# EasyEDA schematic CLIPPER SCHEMATIC.json
TITLE: Sheet_1; REV: 1.0; Date: 2023-09-24; Sheet: 1/1; Drawn By: pv8821; Company: Your Company
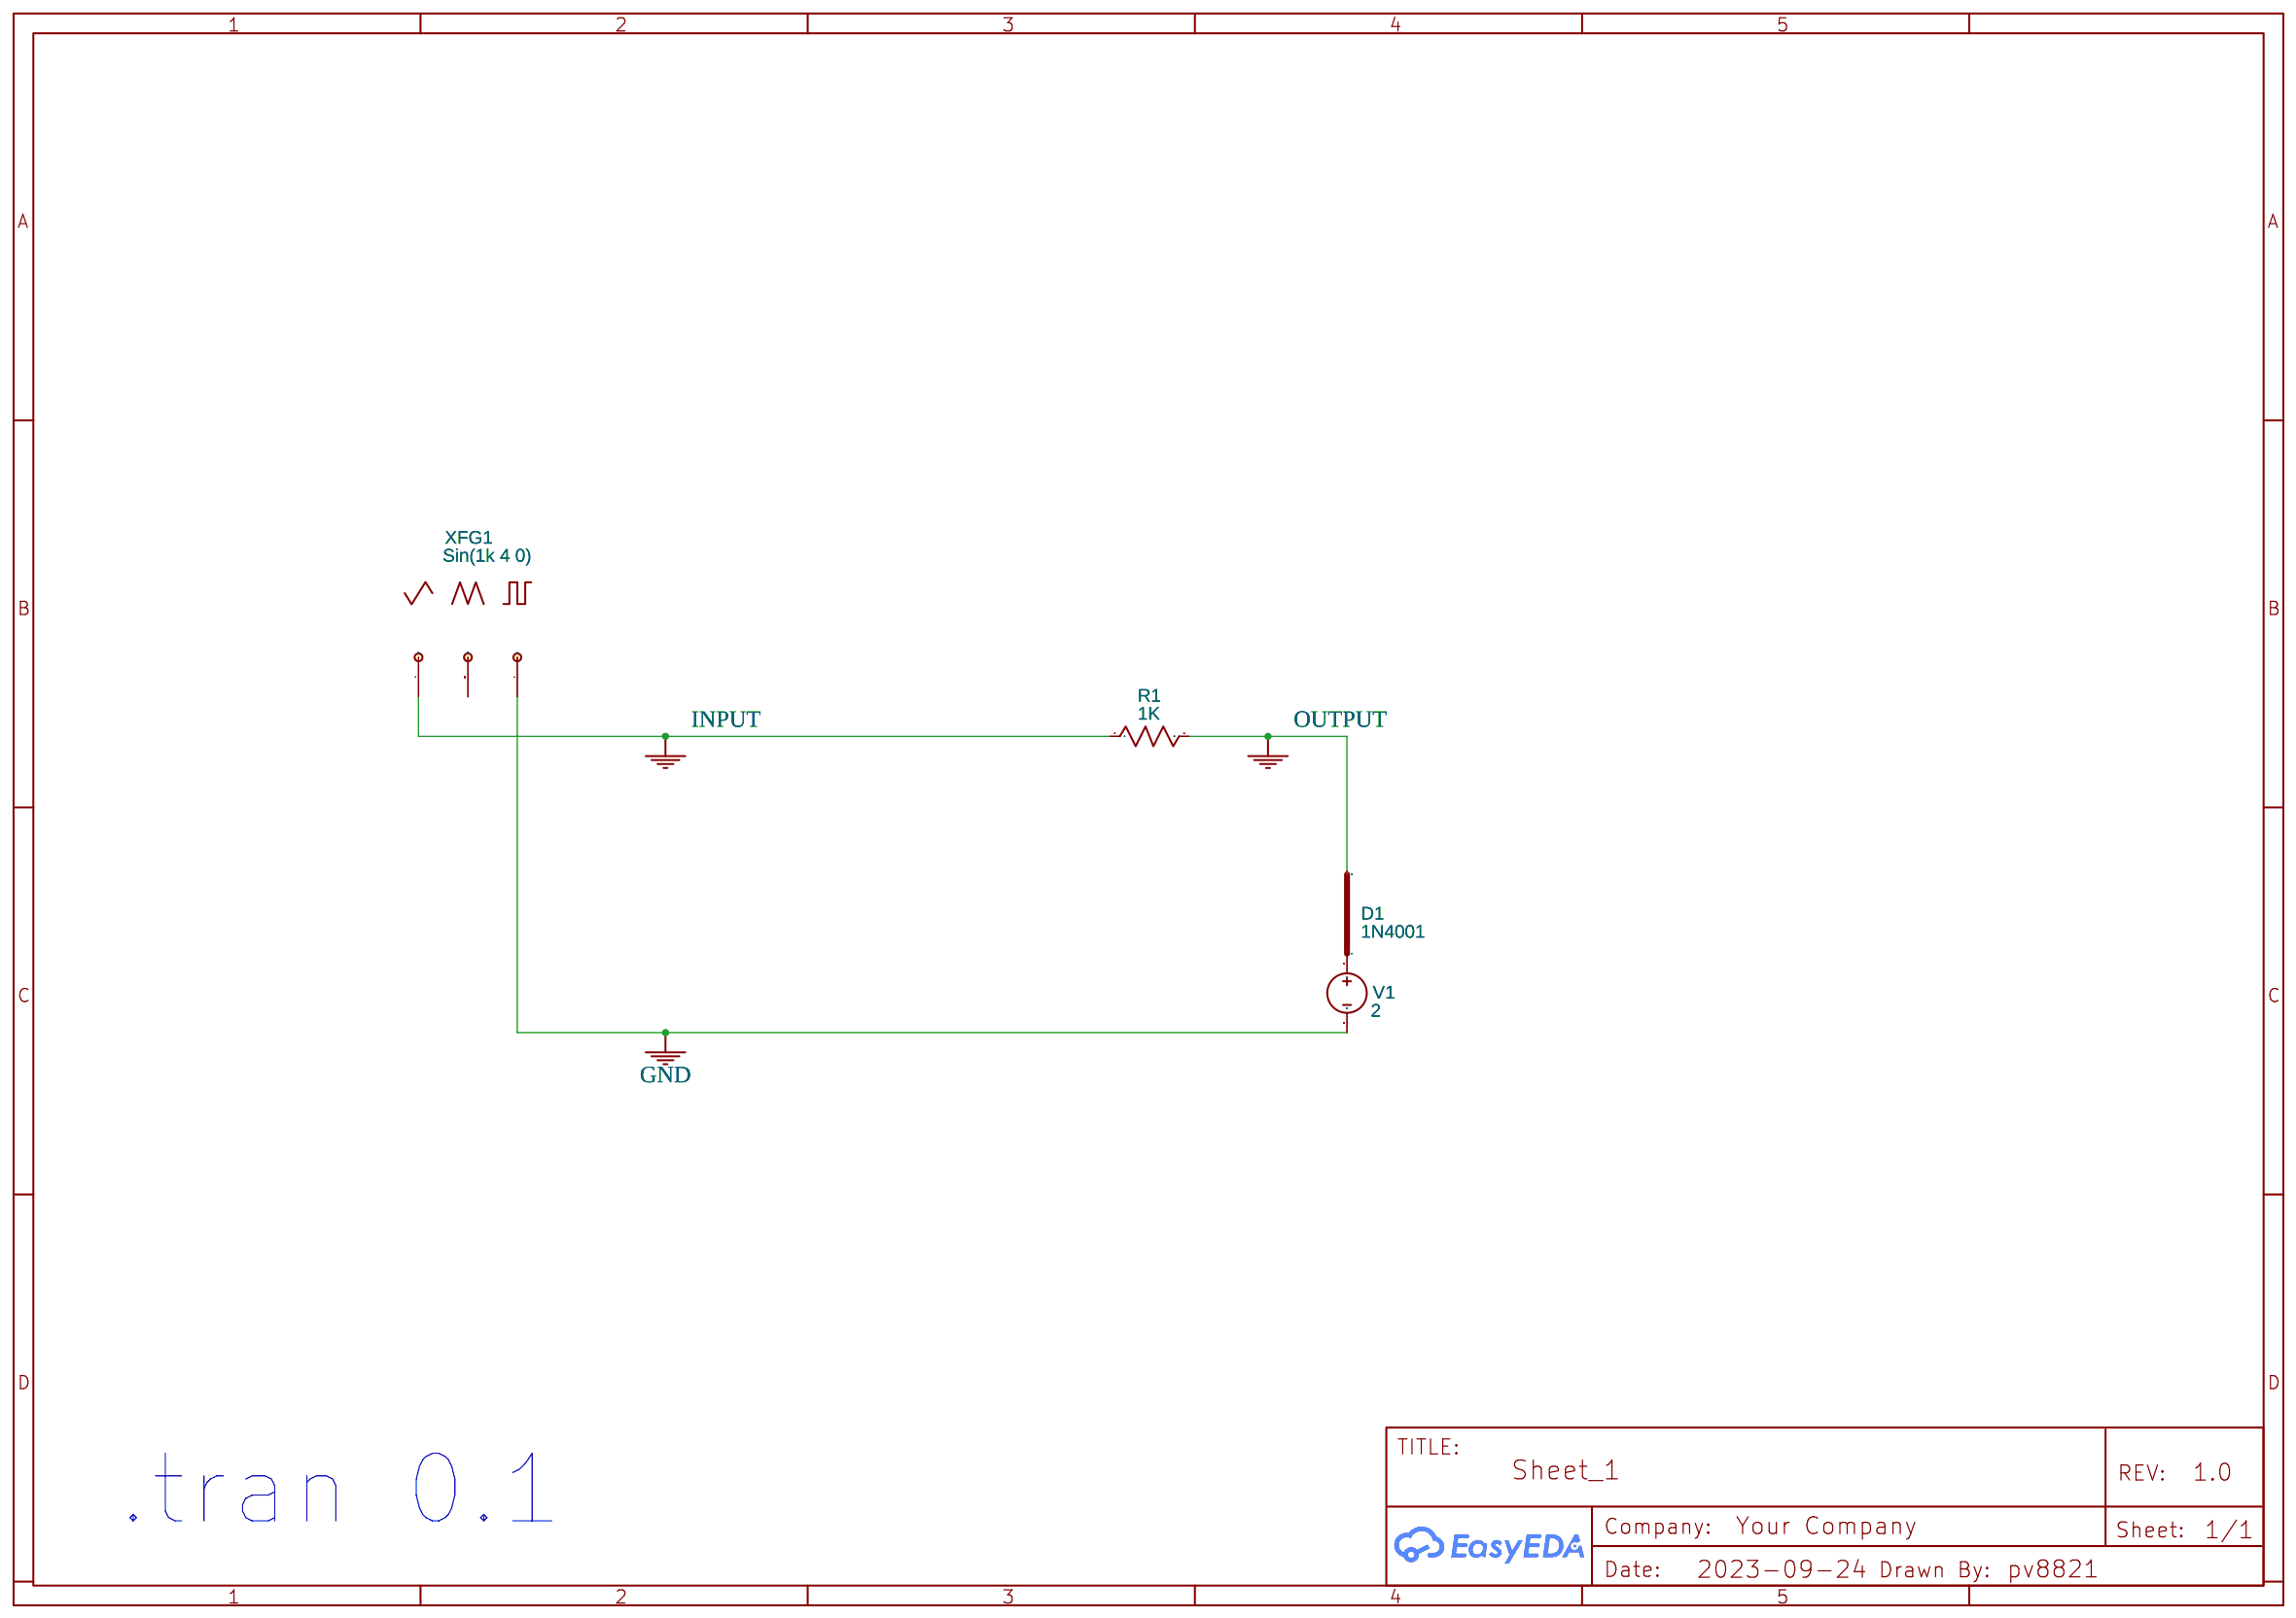
[diagram p0: schematic sheet]

## Parts
D1  1N4001
R1  1K  [AXIAL-0.3]
V1  2  [HDR1X2]
XFG1  Sin(1k 4 0)

## Library data of the parts
D1 = 1N4001: catid: 20; Contributor: EasyEDA; sim: true
R1 = Resistor_US: Resistance: 1k; Contributor: EasyEDA; Supplier: YUJING
V1 = VDC: Contributor: EasyEDA; sim: true
XFG1 = FUNCTIONGENERATOR: Supplier: LCSC; Waveforms: Sine Wave; Frequency: 1k; Duty cycle: 50; Amplitude: 4; Offset: 0; Rise/Fall Time: 10; NameDisplay: 1; Contributor: EasyEDA; sim: true

## Nets
GND: V1.2 XFG1.-
INPUT: R1.1 XFG1.+
OUTPUT: D1.2 R1.2
Net-(D1-1): D1.1 V1.1

Not connected (* = marked no-connect by the designer): XFG1 COM

## Notes on the sheet
- .tran 0.1
